# EAGLE design tiny-ws2812b (EAGLE 6.5.0)
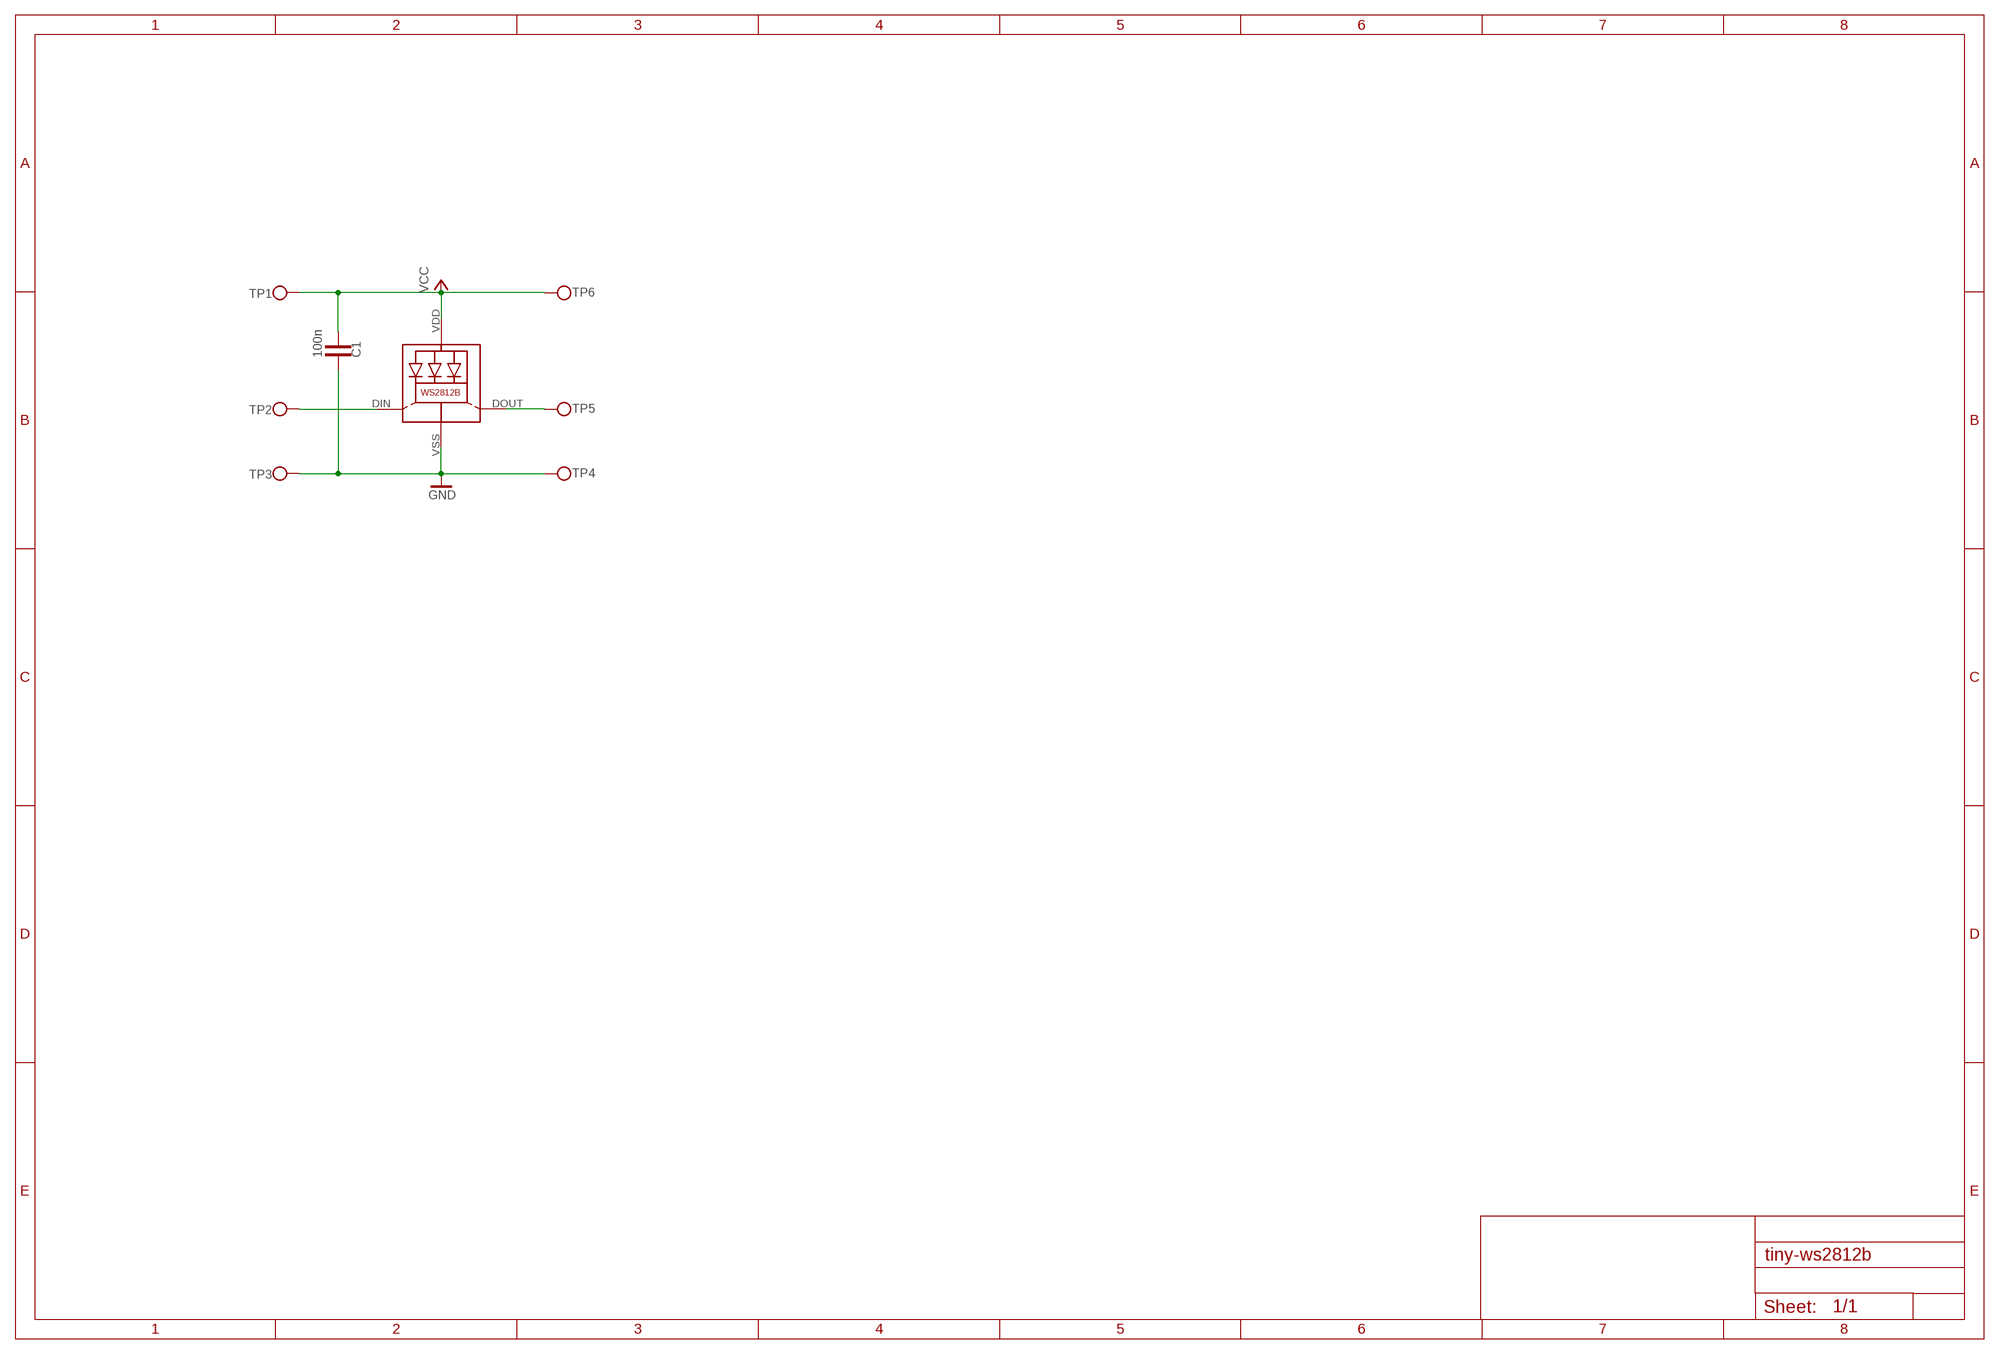
[diagram p0: schematic, sheet 1]

## Parts
C1  100n  C0603  [0603MIL]
LED1  WS2812B  [WS2812B]
TP1  TP_Q2X1MM  [PAD_Q2X1MM]
TP2  TP_Q2X1MM  [PAD_Q2X1MM]
TP3  TP_Q2X1MM  [PAD_Q2X1MM]
TP4  TP_Q2X1MM  [PAD_Q2X1MM]
TP5  TP_Q2X1MM  [PAD_Q2X1MM]
TP6  TP_Q2X1MM  [PAD_Q2X1MM]

## Nets
GND: C1.1 LED1.VSS(GND) TP3.1 TP4.1
N$1: LED1.DOUT(DO) TP5.1
N$2: LED1.DIN(DI) TP2.1
VCC: C1.2 LED1.VDD TP1.1 TP6.1

## Library data of the parts
C1 = tiny:C: C Kondensator im Chip-Gehäuse
LED1 = tiny:WS2812B: Features and Benefits  * Intelligent reverse connect protection, the power supply reverse connection does not damage the IC. * The control circuit and the LED share the only power source. Control circuit and RGB chip are integrated in a package of 5050 components, form a complete control of pixel point.  * Built-in signal reshaping circuit, after wave reshaping to the next driver, ensure wave-form distortion not accumulate.  * Built-in electric reset circuit and power lost reset circuit.  * Each pixel of the three primary color can achieve 256 brightness display, completed 16777216 color full color display, and scan frequency not less than 400Hz/s.  * Cascading port transmission signal by single line.  * Any two point the distance more than 5m transmission signal without any increase circuit.  * When the refresh rate is 30fps, cascade number are not less than1024 points.  * Send data at speeds of 800Kbps.  *The color of the light were highly consistent, cost-effective. Applications  Full-color module, Full color soft lights a lamp strip. LED decorative lighting, Indoor/outdoor LED video irregular screen. General description WS2812B is a intelligent control LED light source that the control circuit and RGB chip are integrated in a package of 5050 components. It internal include intelligent digital port data latch and signal reshaping amplification drive circuit. Also include a precision internal oscillator and a 12V voltage programmable constant curre-nt control part, effectively ensuring the pixel point light color height consistent. The data transfer protocol use single NZR communication mode. After the pixel power-on reset, the DIN port receive data from controller, the first pixel collect initial 24bit data then sent to the internal data latch, the other data which reshaping by the internal signal reshaping amplification circuit sent to the next cascade pixel through the DO port. After transmission for each pixel,the signal to reduce 24bit. pixel adopt auto reshaping transmit technology, making the pixel cascade number is not limited the signal transmission, only depend on the speed of signal transmission. LED with low driving voltage, environmental protection and energy saving, high brightness, scattering angle is large, good consistency, low power, long life and other advantages. The control chip integrated in LED above becoming more simple circuit, small volume, convenient installation. Absolute Maximum Ratings Power supply voltage: VDD +3.5V..+5.3V Input voltage: VI -0.5V..VDD+0.5V based on WS2812 from https://github.com/adafruit/Adafruit-Eagle-Library
TP1-TP6 = tiny:TP

## Board
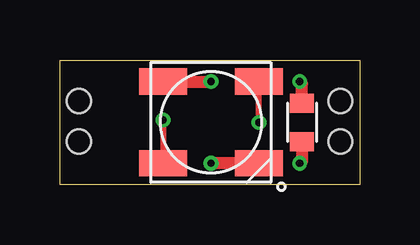
[diagram p1: board, top side]
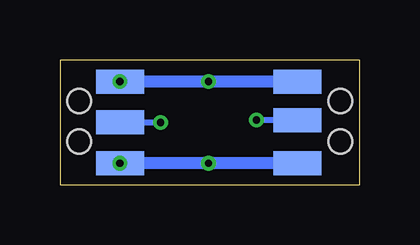
[diagram p2: board, bottom side, seen from below]

Size 12.5 x 5.2 mm. Coordinates in mm from the lower left corner, seen from the top.
Outline: 0,5.2 12.5,5.2 12.5,0 0,0 0,5.2
Copper layers (1*16): Top 0.035mm / dielectric 1.5mm / Bottom 0.035mm
Design rules "SeeedStudio_DRU-2layer_no_angle_20130527 *": minimum track width 6mil, minimum drill 12mil, track to track 6mil, track to pad 6mil, pad to pad 6mil, via to via 6mil, smd to smd 0mil, copper to edge 10mil, drill to drill 10mil, minimum pad ring 10mil, minimum via ring 6mil, stop-mask expansion 2mil, vias tented up to drill 25mil, thermal gap 10mil
Holes 1 mm at 0.8,3.5 0.8,1.8 11.7,3.5 11.7,1.8

### Footprints (pad centres in the part's own frame; a part is rotated, then mirrored left to right if it is on the bottom)
0603MIL = smd 0.8 x 1: 1 -0.8,0; 2 0.8,0
WS2812B = smd 2 x 1.1: DIN 2,1.7; DOUT -2,-1.7; VDD -2,1.7; VSS 2,-1.7
PAD_Q2X1MM = smd 2 x 1: 1 0,0

### Placement (x,y rotation side)
C1  10.1,2.6 90 top
LED1  6.3,2.6 0 top
TP1  10,4.3 0 bottom
TP2  10,2.6 0 bottom
TP3  10,0.9 0 bottom
TP4  2.6,0.9 0 bottom
TP5  2.6,2.7 0 bottom
TP6  2.6,4.3 0 bottom

### Tracks (layer width: path | path; a pad name or v marks a point on that pad's centre or on a via)
GND  (via drill 0.3)
  Top 0.5: LED1.VSS v6.3,0.9 | C1.1 10.1,1 TP3.1
  Bottom 0.5: TP4.1 v6.3,0.9 TP3.1
  other vias: 10,0.9
N$1  (via drill 0.3)
  Top 0.25: v4.3,2.7 LED1.DOUT
  Bottom 0.25: TP5.1 v4.3,2.7
N$2  (via drill 0.3)
  Top 0.25: v8.3,2.6 LED1.DIN
  Bottom 0.25: TP2.1 v8.3,2.6
VCC  (via drill 0.3)
  Top 0.5: LED1.VDD v6.3,4.3 | C1.2 10.1,4.2 TP1.1
  Bottom 0.5: TP6.1 v6.3,4.3 TP1.1
  other vias: 10,4.3